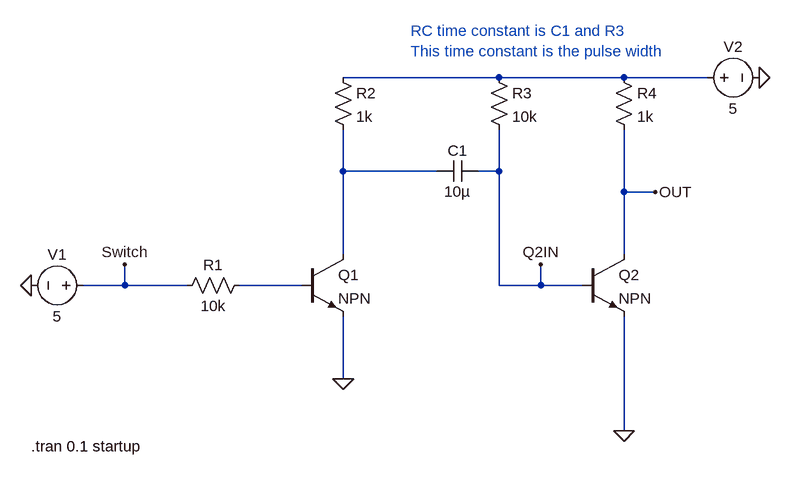
[diagram p0: schematic Pulse Generator.asc]
Pulse Generator.asc, the LTspice schematic file:
Version 4
SHEET 1 1076 680
WIRE 656 -160 416 -160
WIRE 848 -160 656 -160
WIRE 976 -160 848 -160
WIRE 416 -16 416 -80
WIRE 560 -16 416 -16
WIRE 656 -16 656 -80
WIRE 656 -16 624 -16
WIRE 848 16 848 -80
WIRE 896 16 848 16
WIRE 416 112 416 -16
WIRE 848 112 848 16
WIRE 80 160 80 128
WIRE 80 160 16 160
WIRE 176 160 80 160
WIRE 352 160 256 160
WIRE 656 160 656 -16
WIRE 720 160 720 128
WIRE 720 160 656 160
WIRE 784 160 720 160
WIRE 416 304 416 208
WIRE 848 384 848 208
FLAG 848 384 0
FLAG 416 304 0
FLAG -64 160 0
FLAG 1056 -160 0
FLAG 896 16 OUT
FLAG 720 128 Q2IN
FLAG 80 128 Switch
SYMBOL voltage 32 160 R90
WINDOW 0 -32 56 VBottom 2
WINDOW 3 32 56 VTop 2
WINDOW 123 0 0 Left 0
WINDOW 39 0 0 Left 0
SYMATTR InstName V1
SYMATTR Value 5
SYMBOL res 272 144 R90
WINDOW 0 0 56 VBottom 2
WINDOW 3 32 56 VTop 2
SYMATTR InstName R1
SYMATTR Value 10k
SYMBOL npn 352 112 R0
SYMATTR InstName Q1
SYMBOL cap 624 -32 R90
WINDOW 0 0 32 VBottom 2
WINDOW 3 32 32 VTop 2
SYMATTR InstName C1
SYMATTR Value 10µ
SYMBOL res 400 -176 R0
SYMATTR InstName R2
SYMATTR Value 1k
SYMBOL res 832 -176 R0
SYMATTR InstName R4
SYMATTR Value 1k
SYMBOL npn 784 112 R0
SYMATTR InstName Q2
SYMBOL res 640 -176 R0
SYMATTR InstName R3
SYMATTR Value 10k
SYMBOL voltage 960 -160 R270
WINDOW 0 32 56 VTop 2
WINDOW 3 -32 56 VBottom 2
WINDOW 123 0 0 Left 0
WINDOW 39 0 0 Left 0
SYMATTR InstName V2
SYMATTR Value 5
TEXT -64 408 Left 2 !.tran 0.1 startup
TEXT 520 -232 Left 2 ;RC time constant is C1 and R3\nThis time constant is the pulse width

The netlist it stands for:
* Pulse Generator.asc
V1 Switch 0 5
R1 N003 Switch 10k
Q1 N002 N003 0 0 NPN
C1 Q2IN N002 10µ
R2 N001 N002 1k
R4 N001 OUT 1k
Q2 OUT Q2IN 0 0 NPN
R3 N001 Q2IN 10k
V2 N001 0 5
.model NPN NPN
.model PNP PNP
.lib standard.bjt
.tran 0.1 startup
* RC time constant is C1 and R3
* This time constant is the pulse width
.backanno
.end